# EAGLE design iv-11_breakout (EAGLE 6.5.0)
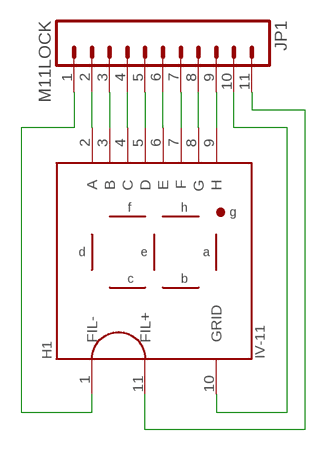
[diagram p0: schematic, sheet 1]

## Parts
H1  IV-11  [IV-11]
JP1  M11LOCK  [1X11_LOCK]

## Nets
N$1: H1.2(A) JP1.2
N$2: H1.3(B) JP1.3
N$3: H1.4(C) JP1.4
N$4: H1.5(D) JP1.5
N$5: H1.6(E) JP1.6
N$6: H1.7(F) JP1.7
N$7: H1.8(G) JP1.8
N$8: H1.9(H) JP1.9
N$9: H1.1(FIL-) JP1.1
N$10: H1.10(GRID) JP1.10
N$11: H1.11(FIL+) JP1.11

## Library data of the parts
H1 = boz:IV-11: IV-11 VFD Tube
JP1 = SparkFun-Connectors:M11: Header 11 Standard 11-pin 0.1" header. Use with straight break away headers (SKU : PRT-00116), right angle break away headers (PRT-00553), swiss pins (PRT-00743), machine pins (PRT-00117), and female headers (PRT-00115).

## Board
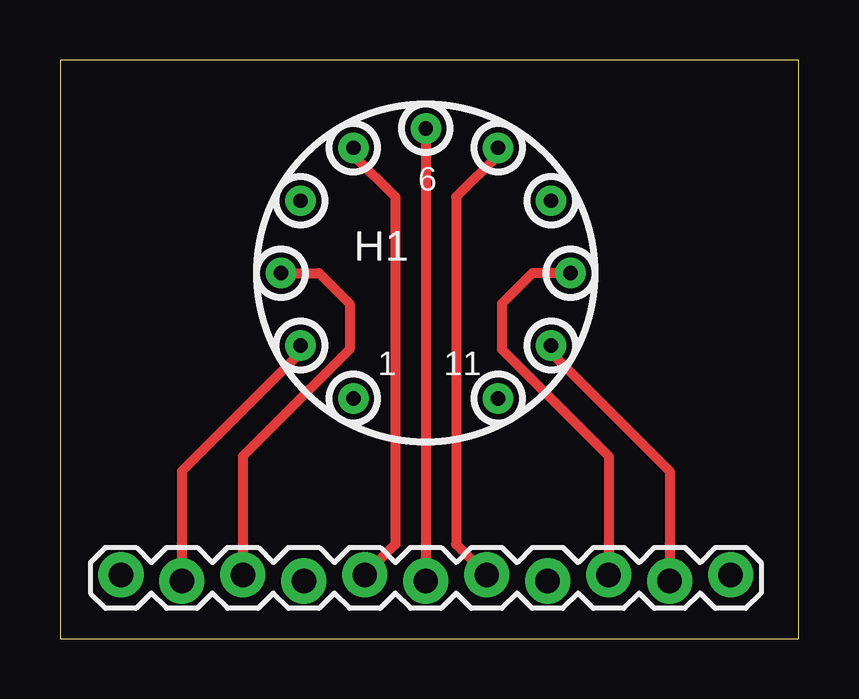
[diagram p1: board, top side]
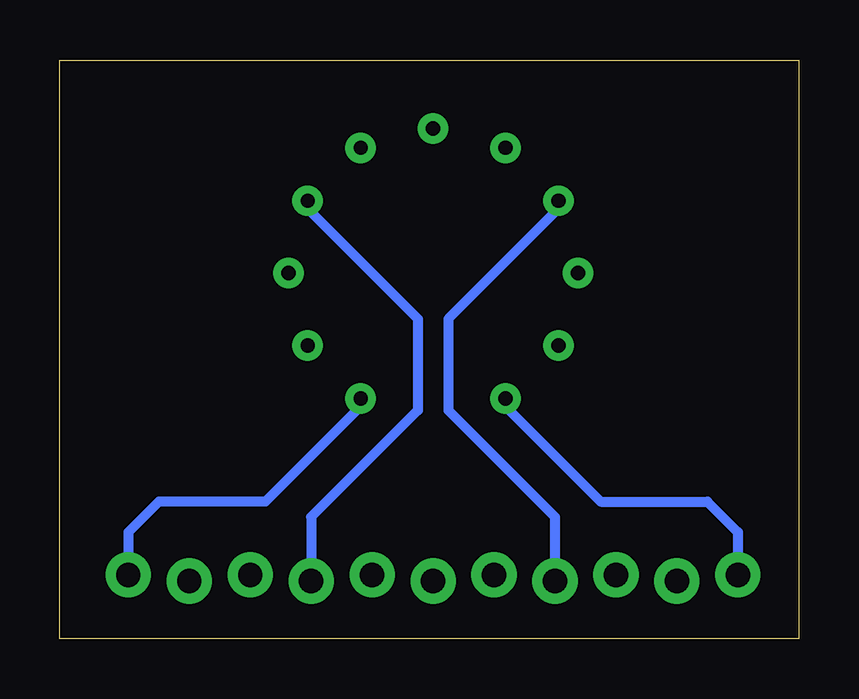
[diagram p2: board, bottom side, seen from below]

Size 30.79 x 24.12 mm. Coordinates in mm from the lower left corner, seen from the top.
Outline: 0,0 30.79,0 30.79,24.12 0,24.12 0,0
Copper layers (1*16): Top 0.0356mm / dielectric 1.5011mm / Bottom 0.0356mm
Design rules "LaenPCBOrder": minimum track width 6mil, minimum drill 13mil, track to track 6mil, track to pad 6mil, pad to pad 6mil, via to via 6mil, smd to smd 6mil, copper to edge 15mil, drill to drill 6mil, minimum pad ring 7mil, minimum via ring 7mil, stop-mask expansion 3mil, vias tented up to drill 0mil, thermal gap 10mil

### Footprints (pad centres in the part's own frame; a part is rotated, then mirrored left to right if it is on the bottom)
IV-11 = drill 0.6 pad 1.27: 1 -3.015,-5.223; 2 -5.223,-3.015; 3 -6.03,0; 4 -5.223,3.015; 5 -3.015,5.223; 6 0,6.03; 7 3.015,5.223; 8 5.223,3.015; 9 6.03,0; 10 5.223,-3.015; 11 3.015,-5.223
1X11_LOCK = drill 1.016 pad 1.88: 1 0,0.127; 2 2.54,-0.127; 3 5.08,0.127; 4 7.62,-0.127; 5 10.16,0.127; 6 12.7,-0.127; 7 15.24,0.127; 8 17.78,-0.127; 9 20.32,0.127; 10 22.86,-0.127; 11 25.4,0.127

### Placement (x,y rotation side)
H1  15.24,15.24 0 top
JP1  2.54,2.54 0 top

### Tracks (layer width: path | path; a pad name or v marks a point on that pad's centre or on a via)
N$1
  Top 0.406: H1.2 10.02,11.92 5.08,6.99 JP1.2
N$2
  Top 0.406: H1.3 10.79,15.24 12.06,13.97 12.06,12.06 7.62,7.62 JP1.3
N$3
  Bottom 0.406: H1.4 10.02,17.92 14.61,13.34 14.61,9.53 10.16,5.08 JP1.4
N$4
  Top 0.406: H1.5 12.22,20.16 13.97,18.41 13.97,3.94 JP1.5
N$5
  Top 0.406: H1.6 JP1.6
N$6
  Top 0.406: H1.7 18.25,20.16 16.51,18.41 16.51,3.94 JP1.7
N$7
  Bottom 0.406: H1.8 20.46,17.92 15.88,13.34 15.88,9.53 20.32,5.08 JP1.8
N$8
  Top 0.406: H1.9 19.68,15.24 18.41,13.97 18.41,12.06 22.86,7.62 JP1.9
N$9
  Bottom 0.406: H1.1 12.22,9.69 8.26,5.71 3.81,5.71 2.54,4.45 JP1.1
N$10
  Top 0.406: H1.10 20.46,11.92 25.4,6.99 JP1.10
N$11
  Bottom 0.406: H1.11 18.25,9.69 22.23,5.71 26.67,5.71 27.94,4.45 JP1.11

### Text on the board
tDocu: BOZ / IV-11 / v1 | FIL | A | B | C | D | E | F | G | H | GRID | FIL